# Altium schematic sheet Final_Project.SchDoc
size A4
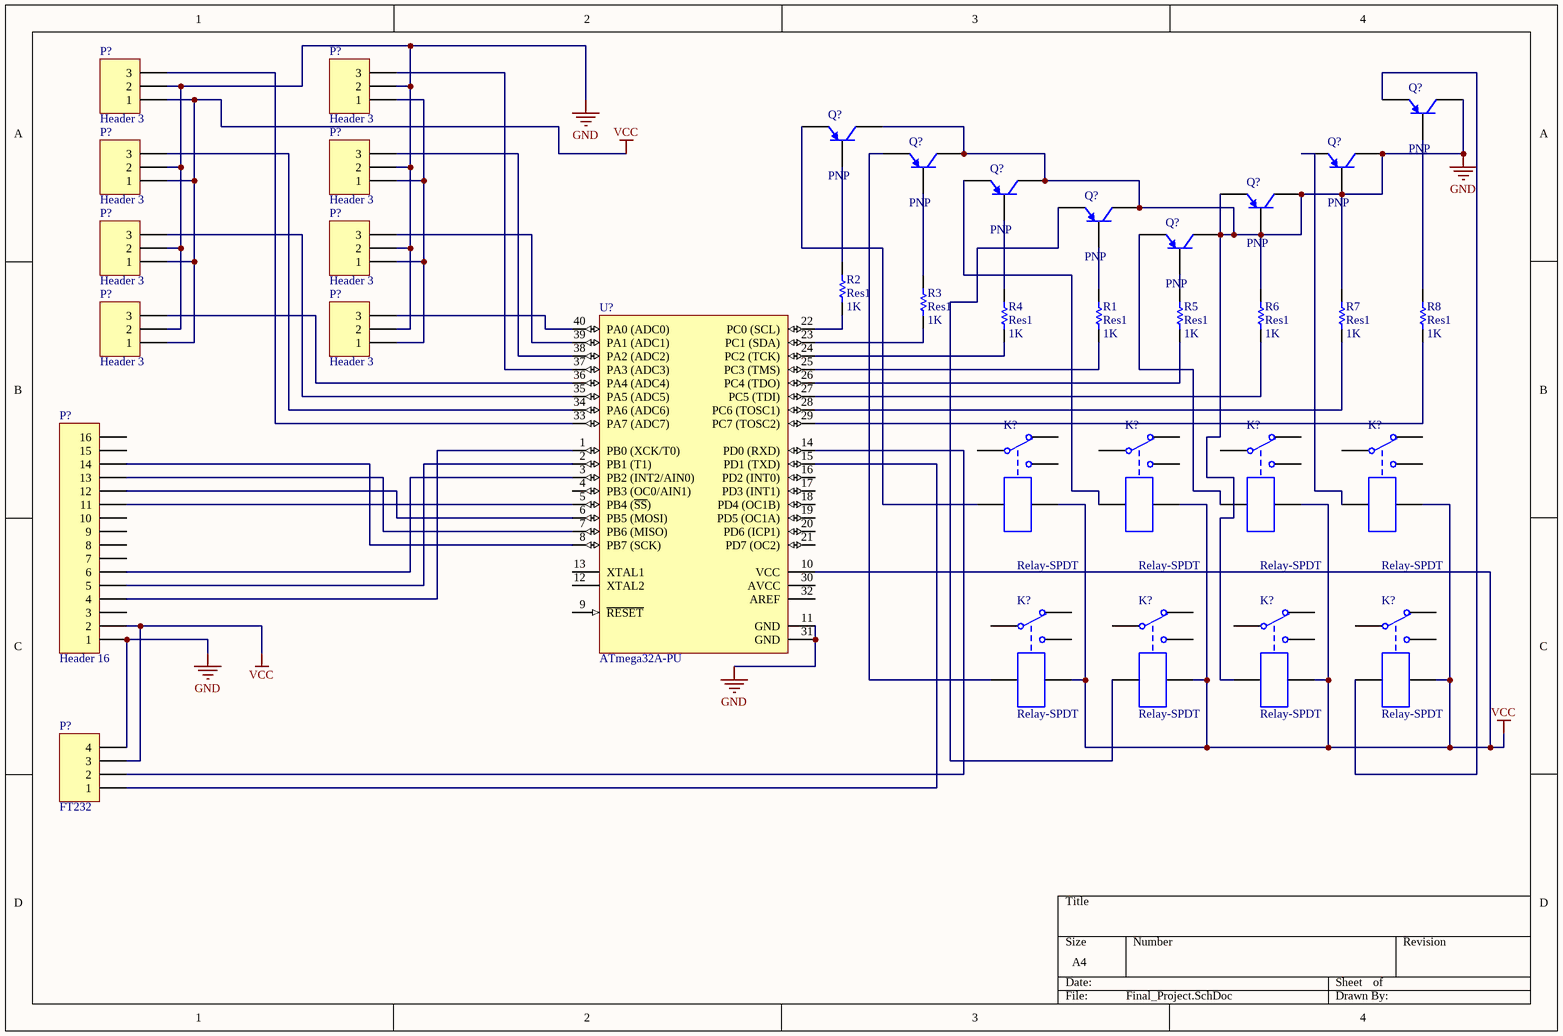
[diagram p0: Final_Project.SchDoc]

## Parts
(Parts that share a designator on the sheet are numbered #1, #2 ... from top to bottom, then left to right.)
K?#1  Relay-SPDT  [DIP-P5/X1.65]
K?#2  Relay-SPDT  [DIP-P5/X1.65]
K?#3  Relay-SPDT  [DIP-P5/X1.65]
K?#4  Relay-SPDT  [DIP-P5/X1.65]
K?#5  Relay-SPDT  [DIP-P5/X1.65]
K?#6  Relay-SPDT  [DIP-P5/X1.65]
K?#7  Relay-SPDT  [DIP-P5/X1.65]
K?#8  Relay-SPDT  [DIP-P5/X1.65]
P?#1  Header 3  [HDR1X3]
P?#2  Header 3  [HDR1X3]
P?#3  Header 3  [HDR1X3]
P?#4  Header 3  [HDR1X3]
P?#5  Header 3  [HDR1X3]
P?#6  Header 3  [HDR1X3]
P?#7  Header 3  [HDR1X3]
P?#8  Header 3  [HDR1X3]
P?#9  Header 16  [HDR1X16]
P?#10  FT232  [HDR1X4]
Q?#1  PNP  [SOT95P240-3N]
Q?#2  PNP  [SOT95P240-3N]
Q?#3  PNP  [SOT95P240-3N]
Q?#4  PNP  [SOT95P240-3N]
Q?#5  PNP  [SOT95P240-3N]
Q?#6  PNP  [SOT95P240-3N]
Q?#7  PNP  [SOT95P240-3N]
Q?#8  PNP  [SOT95P240-3N]
R1  Res1  value 1K  [AXIAL-0.3]
R2  Res1  value 1K  [AXIAL-0.3]
R3  Res1  value 1K  [AXIAL-0.3]
R4  Res1  value 1K  [AXIAL-0.3]
R5  Res1  value 1K  [AXIAL-0.3]
R6  Res1  value 1K  [AXIAL-0.3]
R7  Res1  value 1K  [AXIAL-0.3]
R8  Res1  value 1K  [AXIAL-0.3]
U?  ATmega32A-PU  [40P6]

## Nets
GND: K?#7.4 P?#1.2 P?#2.2 P?#3.2 P?#4.2 P?#5.2 P?#6.2 P?#7.2 P?#8.2 P?#9.1 P?#10.4 Q?#1.1(C) Q?#2.1(C) Q?#3.1(C) Q?#4.1(C) Q?#4.2(B) Q?#5.1(C) Q?#6.1(C) Q?#6.2(B) Q?#6.3(E) Q?#7.1(C) Q?#8.1(C) R6.2 R7.2 U?.11(GND) U?.31(GND)
VCC: K?#1.5 K?#2.5 K?#3.5 K?#4.5 K?#5.5 K?#6.5 K?#7.5 K?#8.5 P?#1.1 P?#3.1 P?#5.1 P?#7.1 P?#9.2 P?#10.3 U?.10(VCC)
NetK?#1_4: K?#1.4 Q?#2.3(E)
NetK?#2_4: K?#2.4 Q?#5.3(E)
NetK?#3_4: K?#3.4 Q?#8.3(E)
NetK?#4_4: K?#4.4 Q?#4.3(E)
NetK?#5_4: K?#5.4 Q?#3.3(E)
NetK?#6_4: K?#6.4 Q?#7.3(E)
NetK?#8_4: K?#8.4 Q?#1.3(E)
NetP?#1_3: P?#1.3 U?.33(PA7_(ADC7))
NetP?#2_1: P?#2.1 P?#4.1 P?#6.1 P?#8.1
NetP?#2_3: P?#2.3 U?.37(PA3_(ADC3))
NetP?#3_3: P?#3.3 U?.34(PA6_(ADC6))
NetP?#4_3: P?#4.3 U?.38(PA2_(ADC2))
NetP?#5_3: P?#5.3 U?.35(PA5_(ADC5))
NetP?#6_3: P?#6.3 U?.39(PA1_(ADC1))
NetP?#7_3: P?#7.3 U?.36(PA4_(ADC4))
NetP?#8_3: P?#8.3 U?.40(PA0_(ADC0))
NetP?#9_4: P?#9.4 U?.1(PB0_(XCK/T0))
NetP?#9_5: P?#9.5 U?.2(PB1_(T1))
NetP?#9_6: P?#9.6 U?.3(PB2_(INT2/AIN0))
NetP?#9_11: P?#9.11 U?.5(PB4_(~{SS}))
NetP?#9_12: P?#9.12 U?.6(PB5_(MOSI))
NetP?#9_13: P?#9.13 U?.7(PB6_(MISO))
NetP?#9_14: P?#9.14 U?.8(PB7_(SCK))
NetP?#10_1: P?#10.1 U?.15(PD1_(TXD))
NetP?#10_2: P?#10.2 U?.14(PD0_(RXD))
NetQ?#1_2: Q?#1.2(B) R8.2
NetQ?#2_2: Q?#2.2(B) R2.2
NetQ?#3_2: Q?#3.2(B) R3.1
NetQ?#5_2: Q?#5.2(B) R4.2
NetQ?#7_2: Q?#7.2(B) R1.2
NetQ?#8_2: Q?#8.2(B) R5.2
NetR1_1: R1.1 U?.25(PC3_(TMS))
NetR2_1: R2.1 U?.22(PC0_(SCL))
NetR3_2: R3.2 U?.23(PC1_(SDA))
NetR4_1: R4.1 U?.24(PC2_(TCK))
NetR5_1: R5.1 U?.26(PC4_(TDO))
NetR6_1: R6.1 U?.27(PC5_(TDI))
NetR7_1: R7.1 U?.28(PC6_(TOSC1))
NetR8_1: R8.1 U?.29(PC7_(TOSC2))

Not connected (* = marked no-connect by the designer): K?#1 1 2 3; K?#2 1 2 3; K?#3 1 2 3; K?#4 1 2 3; K?#5 1 2 3; K?#6 1 2 3; K?#7 1 2 3; K?#8 1 2 3; P?#9 3 7 8 9 10 15 16; U? 4(PB3_(OC0/AIN1)) 9(~{RESET}) 12(XTAL2) 13(XTAL1) 16(PD2_(INT0)) 17(PD3_(INT1)) 18(PD4_(OC1B)) 19(PD5_(OC1A)) 20(PD6_(ICP1)) 21(PD7_(OC2)) 30(AVCC) 32(AREF)

## Library data of the parts
K?#1-K?#8 = Relay-SPDT: Single-Pole Dual-Throw Relay; Published: 24-Mar-1999; LatestRevisionDate: 17-Jul-2002; LatestRevisionNote: Re-released for DXP Platform.; PackageReference: MODULE5B; Publisher: Altium Limited
P?#1-P?#8 = Header 3: Header, 3-Pin; LatestRevisionDate: 17-Jul-2002; LatestRevisionNote: Re-released for DXP Platform.; Publisher: Altium Limited
P?#9 = Header 16: Header, 16-Pin; LatestRevisionDate: 17-Jul-2002; LatestRevisionNote: Re-released for DXP Platform.; Publisher: Altium Limited
P?#10 = Header 4: Header, 4-Pin; LatestRevisionDate: 17-Jul-2002; LatestRevisionNote: Re-released for DXP Platform.; Publisher: Altium Limited
Q?#1-Q?#8 = PNP: PNP Bipolar Transistor; Published: 8-Jun-2000; LatestRevisionDate: 29-May-2009; LatestRevisionNote: IPC-7351 Footprint Added.; PackageVersion: Aug-1999; PackageReference: SOT-23B; Publisher: Altium Limited; PackageDescription: 3-Pin SOT-23 Package 0.95 mm Pitch, 2.4 mm Lead Span
R1-R8 = Res1: Resistor; Published: 8-Jun-2000; LatestRevisionDate: 17-Jul-2002; LatestRevisionNote: Re-released for DXP Platform.; PackageReference: AXIAL-0.3; Publisher: Altium Limited
U? = ATmega32A-PU: 8-bit AVR Microcontroller, 32KB Flash, 1KB EEPROM, 2KB SRAM, 40-pin PDIP, Industrial Grade (-40°C to 85°C); Published: 1-Apr-2010; DatasheetVersion: revB, Jul-2009; PackageVersion: revB, Sep-2001; PackageReference: 40P6; Publisher: Altium Limited; PackageDescription: 40-lead (0.600"/15.24mm Wide) Plastic Dual Inline Package (PDIP); Supplier 1: Digi-Key; Supplier Part Number 1: ATMEGA32A-PU-ND; Supplier 2: Farnell; Supplier Part Number 2: 1704565; Supplier 3: Mouser; Supplier Part Number 3: 556-ATMEGA32A-PU; Code_JEDEC: MS-011-AC; ComponentLink1Description: Manufacturer Link; ComponentLink1URL: http://www.atmel.com/products/avr/default.asp?; ComponentLink2Description: ATmega32A Datasheet; ComponentLink2URL: http://www.atmel.com/dyn/resources/prod_documents/doc8155.pdf; ComponentLink3Description: ATmega32A Summary; ComponentLink3URL: http://www.atmel.com/dyn/resources/prod_documents/8155S.pdf; ComponentLink4Description: Atmel.com Home; ComponentLink4URL: http://www.atmel.com